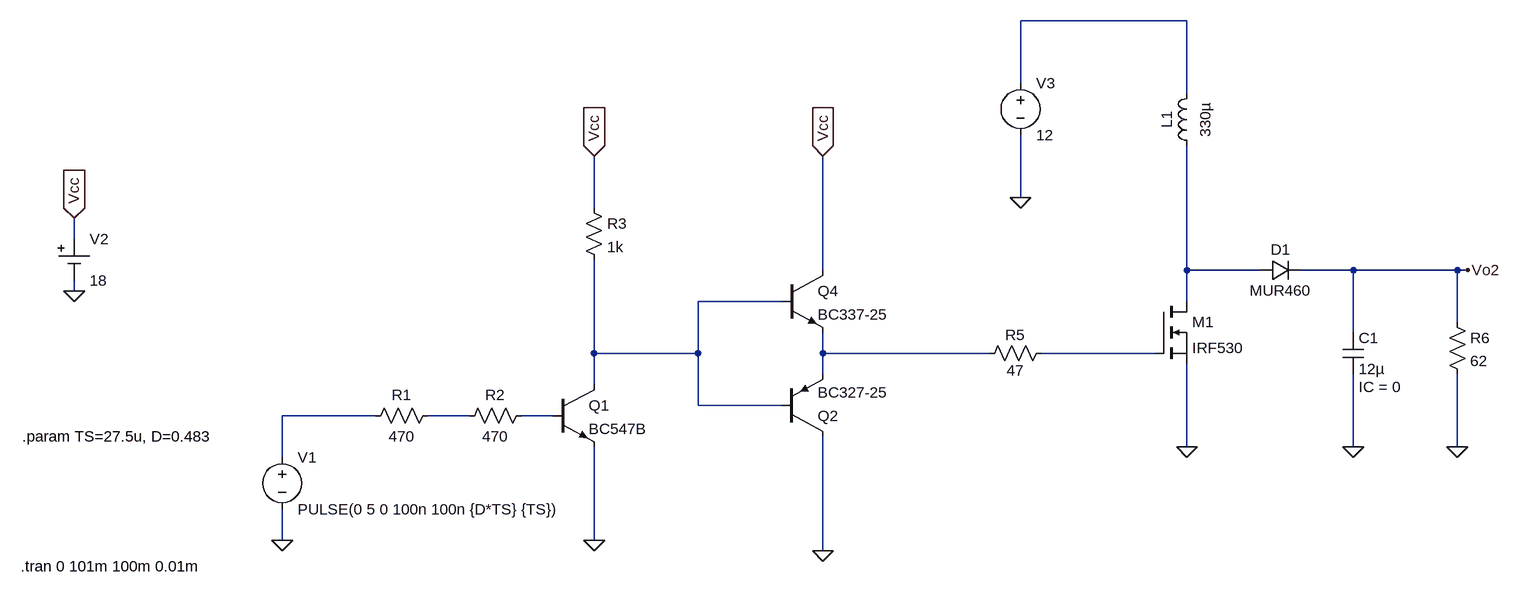
[diagram p0: schematic Draft2.asc]
Draft2.asc, the LTspice schematic file:
Version 4
SHEET 1 2172 680
WIRE 1424 -544 1168 -544
WIRE 1168 -448 1168 -544
WIRE 1424 -432 1424 -544
WIRE 1168 -272 1168 -368
WIRE 512 -256 512 -336
WIRE -288 -208 -288 -240
WIRE 864 -160 864 -336
WIRE 1424 -160 1424 -352
WIRE 1536 -160 1424 -160
WIRE 1680 -160 1600 -160
WIRE 1840 -160 1680 -160
WIRE 1856 -160 1840 -160
WIRE -288 -128 -288 -144
WIRE 800 -112 672 -112
WIRE 1424 -112 1424 -160
WIRE 1840 -80 1840 -160
WIRE 1680 -64 1680 -160
WIRE 512 -32 512 -176
WIRE 672 -32 672 -112
WIRE 672 -32 512 -32
WIRE 864 -32 864 -64
WIRE 1120 -32 864 -32
WIRE 1376 -32 1200 -32
WIRE 864 0 864 -32
WIRE 512 16 512 -32
WIRE 672 48 672 -32
WIRE 800 48 672 48
WIRE 176 64 32 64
WIRE 320 64 256 64
WIRE 448 64 400 64
WIRE 1424 112 1424 -16
WIRE 1680 112 1680 0
WIRE 1840 112 1840 0
WIRE 32 128 32 64
WIRE 32 256 32 208
WIRE 512 256 512 112
WIRE 864 272 864 96
FLAG 32 256 0
FLAG 512 256 0
FLAG -288 -128 0
FLAG -288 -240 Vcc
IOPIN -288 -240 In
FLAG 512 -336 Vcc
IOPIN 512 -336 In
FLAG 864 272 0
FLAG 864 -336 Vcc
IOPIN 864 -336 In
FLAG 1680 112 0
FLAG 1856 -160 Vo2
FLAG 1840 112 0
FLAG 1424 112 0
FLAG 1168 -272 0
SYMBOL voltage 32 112 R0
WINDOW 123 0 0 Left 0
WINDOW 39 0 0 Left 0
SYMATTR InstName V1
SYMATTR Value PULSE(0 5 0 100n 100n {D*TS} {TS})
SYMBOL res 272 48 R90
WINDOW 0 0 56 VBottom 2
WINDOW 3 32 56 VTop 2
SYMATTR InstName R1
SYMATTR Value 470
SYMBOL res 416 48 R90
WINDOW 0 0 56 VBottom 2
WINDOW 3 32 56 VTop 2
SYMATTR InstName R2
SYMATTR Value 470
SYMBOL npn 448 16 R0
SYMATTR InstName Q1
SYMATTR Value BC547B
SYMBOL res 496 -272 R0
SYMATTR InstName R3
SYMATTR Value 1k
SYMBOL Misc\\cell -288 -208 R0
WINDOW 123 0 0 Left 0
WINDOW 39 0 0 Left 0
SYMATTR InstName V2
SYMATTR Value 18
SYMBOL npn 800 -160 R0
SYMATTR InstName Q4
SYMATTR Value BC337-25
SYMBOL pnp 800 96 M180
SYMATTR InstName Q2
SYMATTR Value BC327-25
SYMBOL ind 1440 -336 R180
WINDOW 3 3 56 VBottom 2
WINDOW 0 31 56 VTop 2
WINDOW 123 3 56 VTop 2
SYMATTR Value 330µ
SYMATTR InstName L1
SYMBOL cap 1664 -64 R0
WINDOW 123 24 84 Left 2
SYMATTR Value2 IC = 0
SYMATTR InstName C1
SYMATTR Value 12µ
SYMBOL diode 1536 -144 R270
WINDOW 0 32 32 VTop 2
WINDOW 3 0 32 VBottom 2
SYMATTR InstName D1
SYMATTR Value MUR460
SYMBOL nmos 1376 -112 R0
SYMATTR InstName M1
SYMATTR Value IRF530
SYMBOL res 1216 -48 R90
WINDOW 0 3 56 VBottom 2
WINDOW 3 27 56 VTop 2
SYMATTR InstName R5
SYMATTR Value 47
SYMBOL res 1824 -96 R0
SYMATTR InstName R6
SYMATTR Value 62
SYMBOL voltage 1168 -464 R0
WINDOW 123 0 0 Left 0
WINDOW 39 0 0 Left 0
SYMATTR InstName V3
SYMATTR Value 12
TEXT -368 96 Left 2 !.param TS=27.5u, D=0.483
TEXT -370 296 Left 2 !.tran 0 101m 100m 0.01m

The netlist it stands for:
* Draft2.asc
V1 N006 0 PULSE(0 5 0 100n 100n {D*TS} {TS})
R1 N007 N006 470
R2 N008 N007 470
Q1 N003 N008 0 0 BC547B
R3 Vcc N003 1k
V2 Vcc 0 18
Q4 Vcc N003 N004 0 BC337-25
Q2 0 N003 N004 0 BC327-25
L1 N002 N001 330µ
C1 Vo2 0 12µ IC = 0
D1 N002 Vo2 MUR460
M1 N002 N005 0 0 IRF530
R5 N005 N004 47
R6 Vo2 0 62
V3 N001 0 12
.model D D
.lib standard.dio
.model NPN NPN
.model PNP PNP
.lib standard.bjt
.model NMOS NMOS
.model PMOS PMOS
.lib standard.mos
.param TS=27.5u, D=0.483
.tran 0 101m 100m 0.01m
.backanno
.end